# EAGLE design wireless-dong-mk-2.0 (EAGLE 6.5.0)
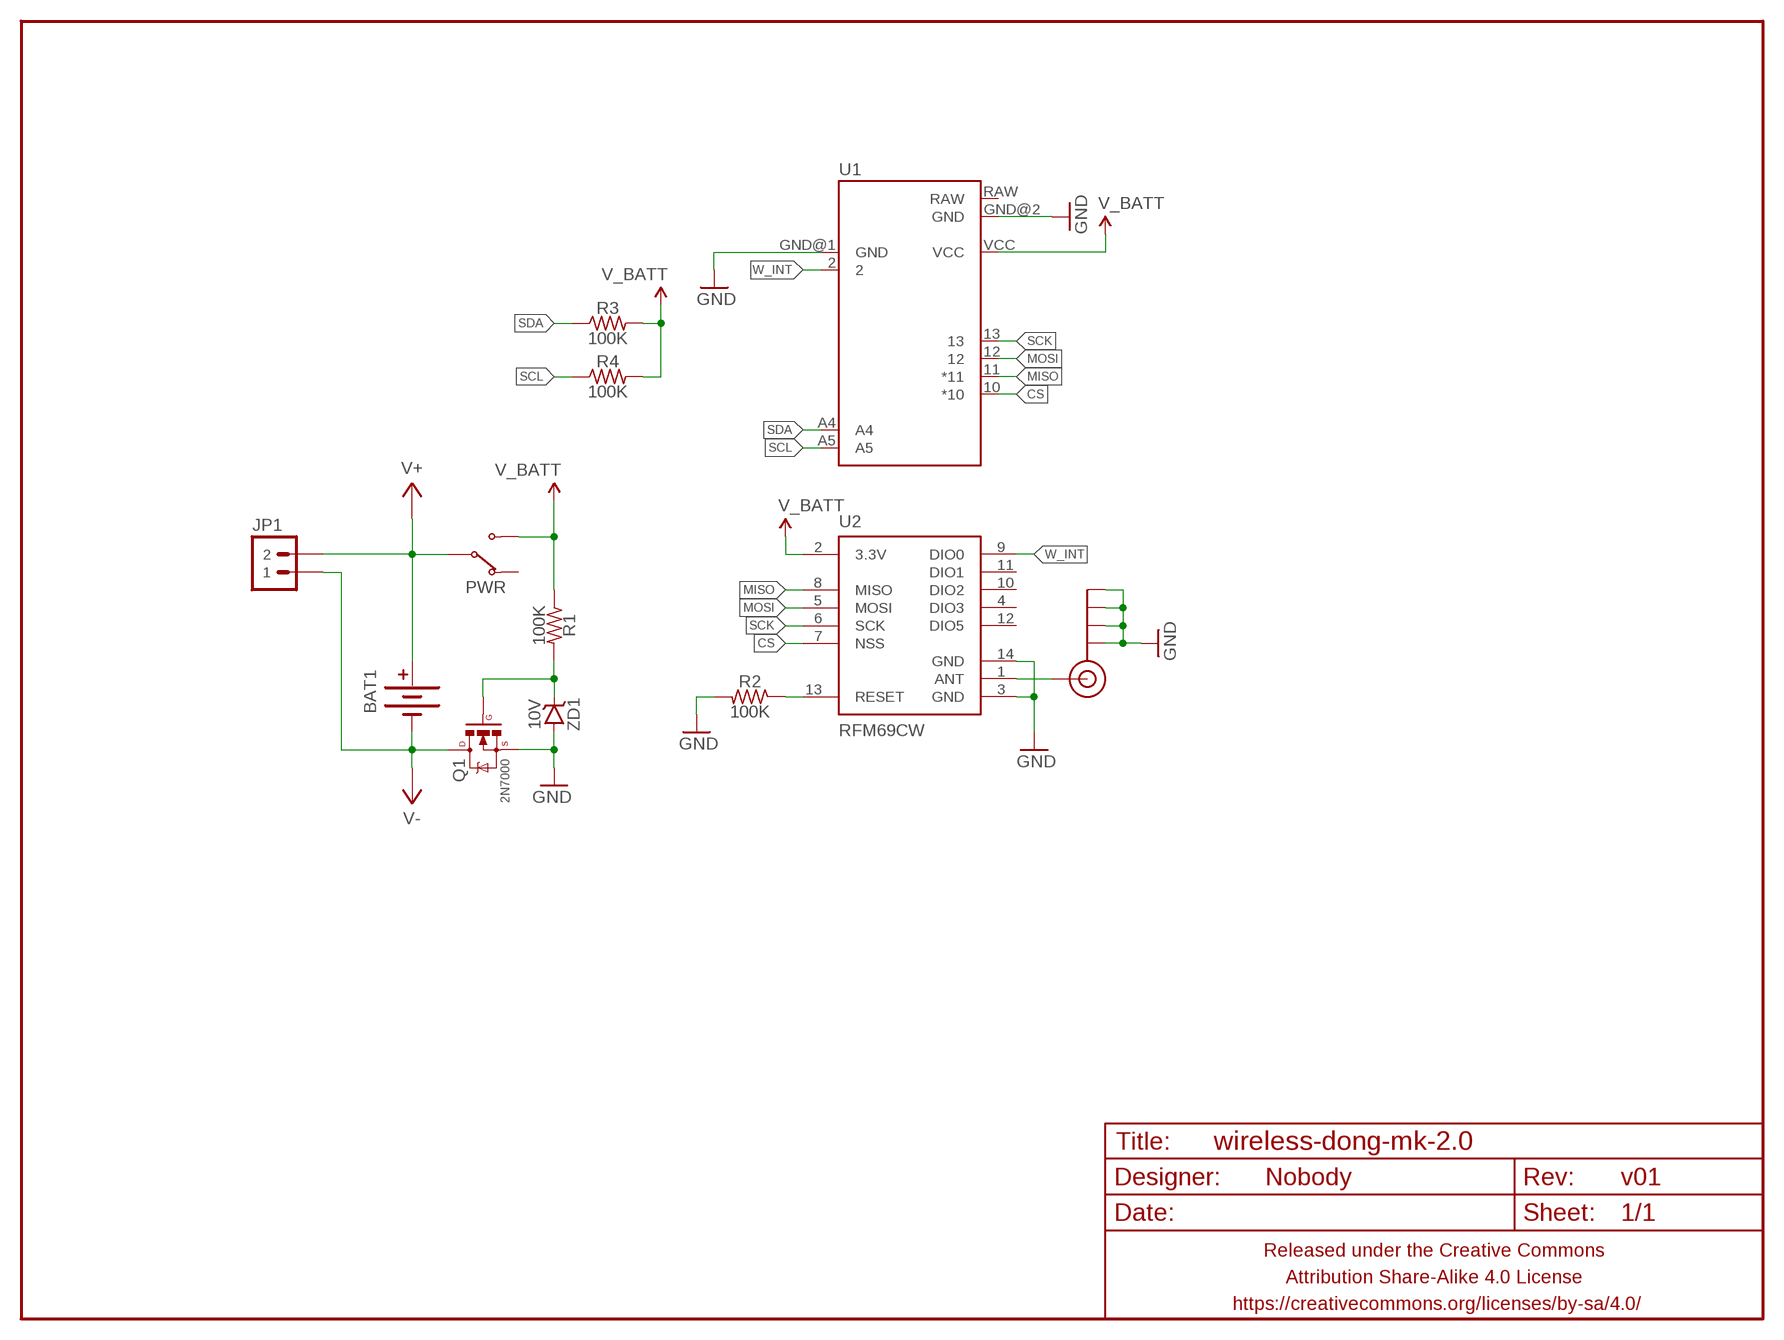
[diagram p0: schematic, sheet 1]

## Parts
BAT1  BATTERY20PTH_TOPLOAD  [BATTCON_20MM_PTH_TOPLOAD]
FRAME1  FRAME-LETTERNO_PACKAGE  [DUMMY]
J$1  SMA_EDGE  [SMA-EDGE]
JP1  M02PTH-CENTERED-R+  [1X02-CENTER-R+]
PWR  SWITCH-SPDTPTH-RA-2.54MM  [SPDT-RA-2.54MM]
Q1  2N7000  MOSFET-NCHANNELIRLML2502  [SOT23]
R1  100K  RESISTORR0603  [R0603]
R2  100K  RESISTORR0603  [R0603]
R3  100K  RESISTORR0603  [R0603]
R4  100K  RESISTORR0603  [R0603]
U1  ARDUINO_PRO_MINI_BOATON_ONE_MF  [ARDUINO_PRO_MINI_BOAT]
U2  RFM69CW  [RFM69CW-XXXS2]
ZD1  10V  DIODE-ZENERSOT23  [SOT23]

## Nets
CS: U1.10(*10) U2.7(NSS)
GND: J$1.GND@0(GND) J$1.GND@1(GND) J$1.GND@2(GND) J$1.GND@3(GND) Q1.2(S) R2.2 U1.GND@1(GND) U1.GND@2(GND) U2.3(GND) U2.14(GND) ZD1.1(A) ZD1.2(A)
MISO: U1.11(*11) U2.8(MISO)
MOSI: U1.12 U2.5(MOSI)
N$1: Q1.1(G) R1.2 ZD1.3(C)
N$3: J$1.SIG(SIGNAL) U2.1(ANT)
N$8: R2.1 U2.13(RESET)
SCK: U1.13 U2.6(SCK)
SCL: R4.1 U1.A5
SDA: R3.1 U1.A4
V+: BAT1.+ JP1.2 PWR.2(COM)
V-: BAT1.- JP1.1 Q1.3(D)
V_BATT: PWR.3(NO) R1.1 R3.2 R4.2 U1.VCC U2.2(3.3V)
W_INT: U1.2 U2.9(DIO0)
Unconnected: PWR.1(NC) U1.RAW U2.4(DIO3) U2.10(DIO2) U2.11(DIO1) U2.12(DIO5)

## Library data of the parts
BAT1 = A_butts:BATTERY: Battery Holders Various common sizes : AA, AAA, 20mm coin cell and 12mm coin cell. 20MM_4LEGS, BATT-10373
FRAME1 = A_butts:FRAME-LETTER: Schematic Frame Standard 8.5x11 US Letter frame; DESIGNER: Nobody; VERSION: v01
J$1 = A_butts:SMA_EDGE: SMA Antenna Connector End launch SMA connector. The paste layer has been removed so that the connector can be hand soldered onto the board after reflow.
JP1 = A_butts:M02: Standard 2-pin 0.1" header. Use with - straight break away headers ( PRT-00116) - right angle break away headers (PRT-00553) - swiss pins (PRT-00743) - machine pins (PRT-00117) - female headers (PRT-00115) Molex polarized connector foot print use with: PRT-08233 with associated crimp pins and housings. 2.54_SCREWTERM for use with PRT-10571. 3.5mm Screw Terminal footprints for PRT-08084 5mm Screw Terminal footprints for use with PRT-08433
PWR = A_butts:SWITCH-SPDT
Q1 = A_butts:MOSFET-NCHANNEL: Common NMOSFET Parts MFG P/N Store ID Prod ID FDD8780 TRANS-09984 SI7820DN TRANS-11055 FDS6630A IC-08089 2N7002PW TRANS-11151 FQP30N06L COM-10213 TRANS-10060 BSS123LT1G TRANS-08345 BSS138 TRANS-00830 BS170 2N7000
R1-R4 = A_butts:RESISTOR: RESISTOR, American symbol
U1 = A_butts:ARDUINO_PRO_MINI_BOAT
U2 = A_butts:RFM69
ZD1 = A_butts:DIODE-ZENER: Zener Diode Production Part - 8199 3.4V Zener Voltage

## Board
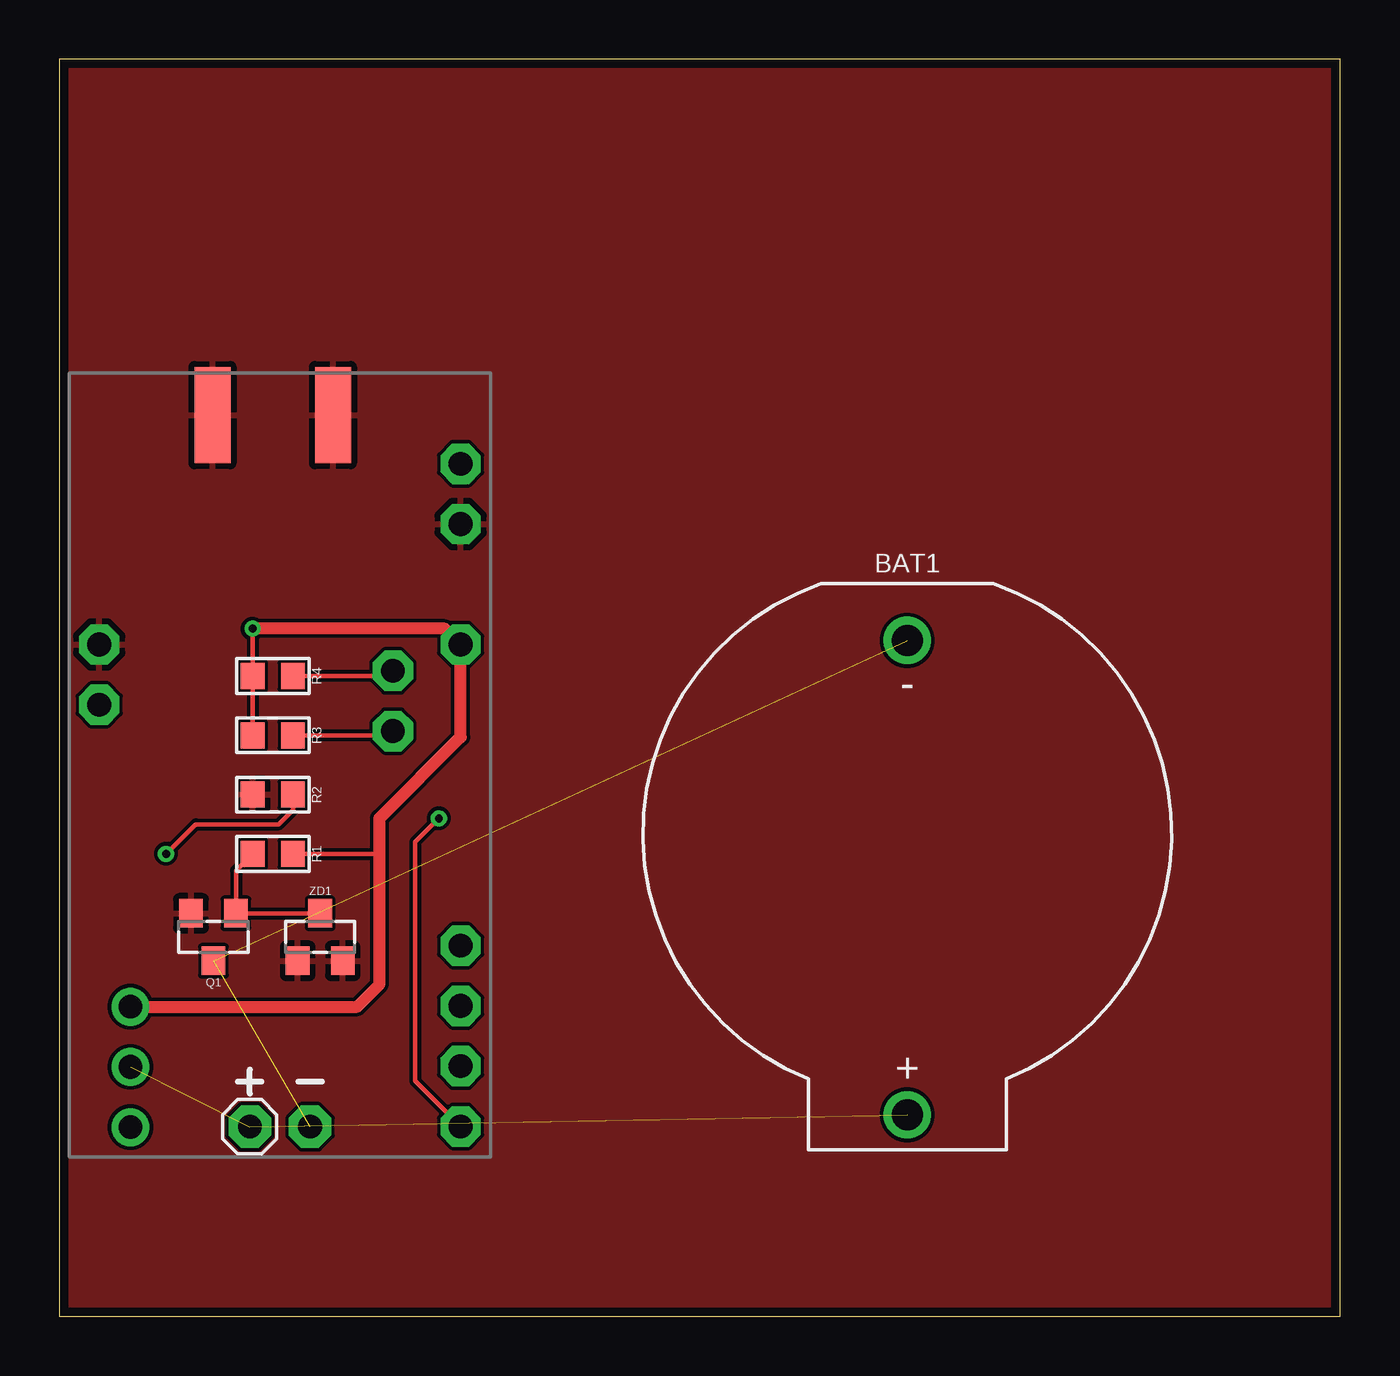
[diagram p1: board, top side]
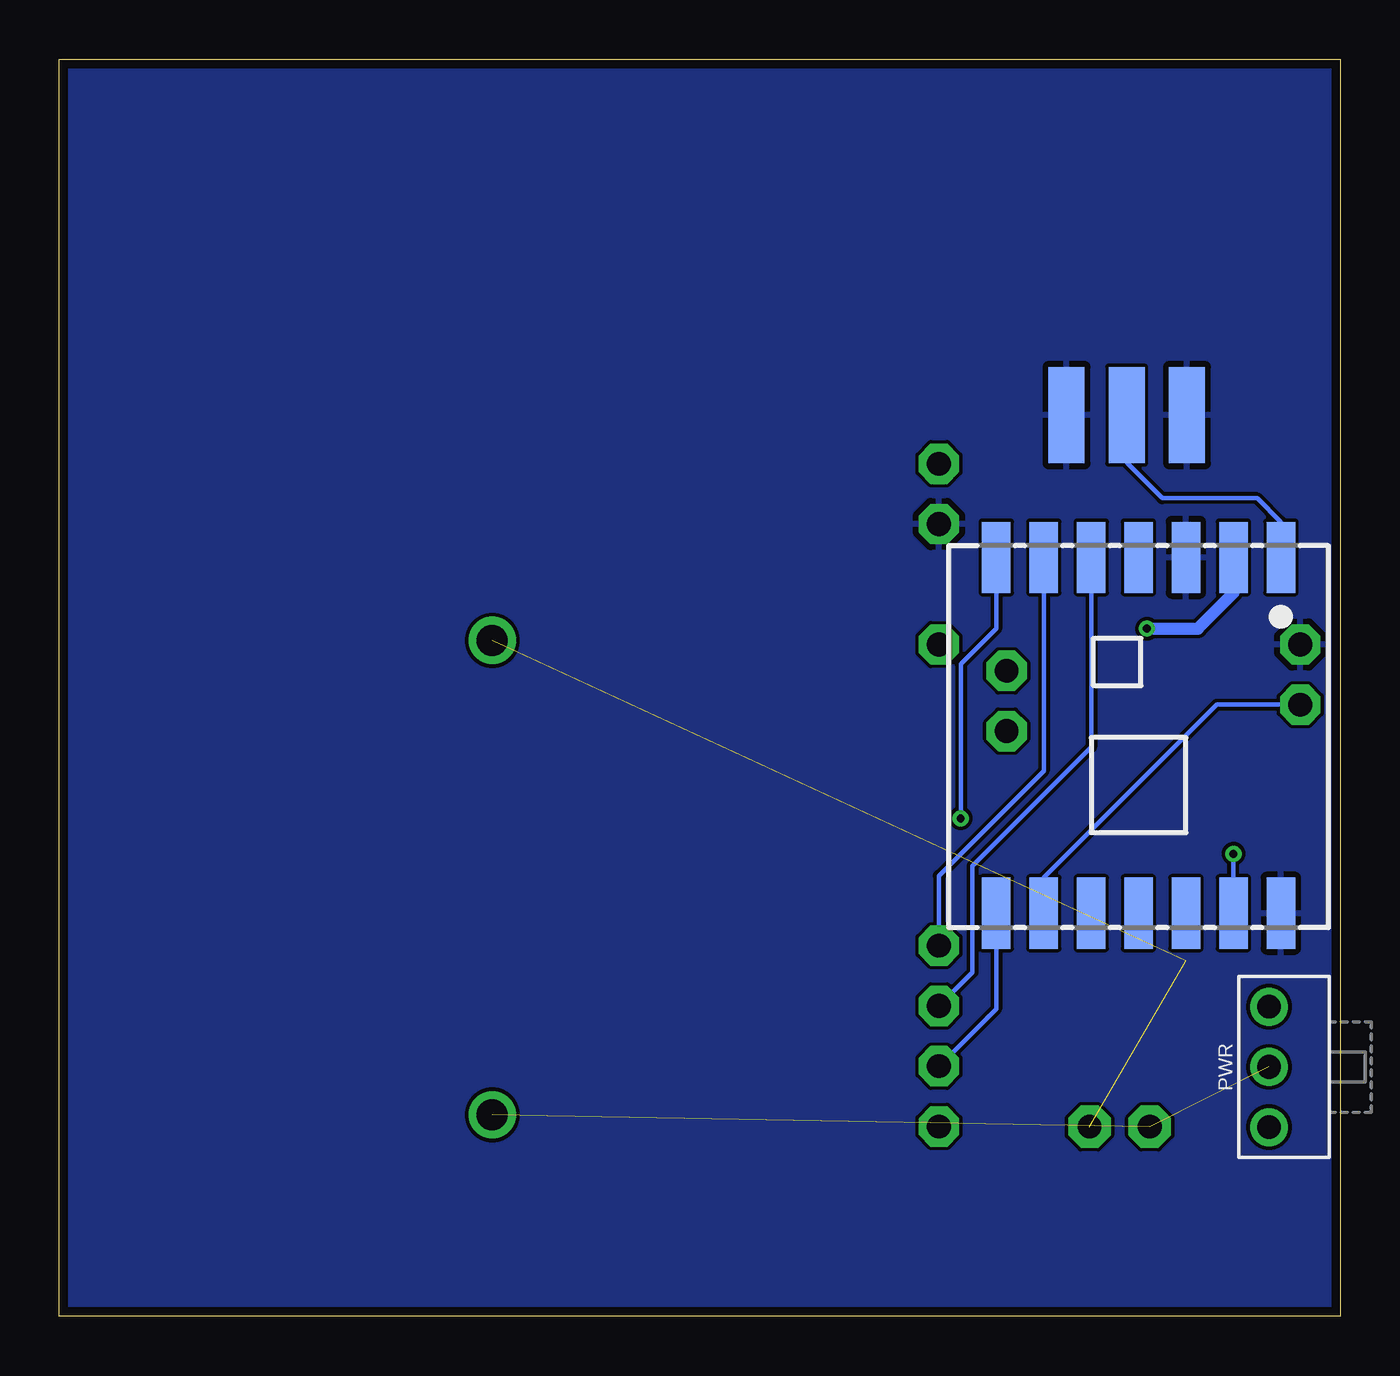
[diagram p2: board, bottom side, seen from below]

Size 54 x 53 mm. Coordinates in mm from the lower left corner, seen from the top.
Outline: 0,0 54,0 54,53 0,53 0,0
Copper layers (1*16): Top 0.0356mm / dielectric 1.5011mm / Bottom 0.0356mm
Design rules "LaenPCBOrder_2": minimum track width 6mil, minimum drill 13mil, track to track 6mil, track to pad 6mil, pad to pad 6mil, via to via 6mil, smd to smd 6mil, copper to edge 15mil, drill to drill 6mil, minimum pad ring 7mil, minimum via ring 7mil, stop-mask expansion 3mil, vias tented up to drill 20mil, thermal gap 10mil

### Footprints (pad centres in the part's own frame; a part is rotated, then mirrored left to right if it is on the bottom)
BATTCON_20MM_PTH_TOPLOAD = drill 1.3 pad 2: + 11.85,0; - -8.15,0
SMA-EDGE = smd 1.524 x 4.064: GND@0 -2.54,0; GND@1 2.54,0; SIG 0,0 | smd 1.524 x 4.064 bottom: GND@2 -2.54,0; GND@3 2.54,0
1X02-CENTER-R+ = drill 1 pad 1.8 octagon: 1 -1.27,0; 2 1.27,0
SPDT-RA-2.54MM = drill 1 pad 1.6: 1 0,0; 2 2.54,0; 3 5.08,0
SOT23 = smd 1 x 1.2: 1 -0.95,-1; 2 0.95,-1; 3 0,1
R0603 = smd 1 x 1.1: 1 -0.85,0; 2 0.85,0
ARDUINO_PRO_MINI_BOAT = drill 1 pad 1.7 octagon: 2 -7.62,2.54; 10 7.62,-15.24; 11 7.62,-12.7; 12 7.62,-10.16; 13 7.62,-7.62; A4 4.763,1.429; A5 4.763,3.969; GND@1 -7.62,5.08; GND@2 7.62,10.16; RAW 7.62,12.7; VCC 7.62,5.08
RFM69CW-XXXS2 = smd 3 x 1.2: 1 -7.5,6; 2 -7.5,4; 3 -7.5,2; 4 -7.5,0; 5 -7.5,-2; 6 -7.5,-4; 7 -7.5,-6; 8 7.5,-6; 9 7.5,-4; 10 7.5,-2; 11 7.5,0; 12 7.5,2; 13 7.5,4; 14 7.5,6

### Placement (x,y rotation side)
BAT1  35.75,20.35 270 top
FRAME1  0,0 0 top
J$1  9,38 180 bottom
JP1  9.3,8 180 top
PWR  3,7.98 90 bottom
Q1  6.5,16 180 top
R1  9,19.5 180 top
R2  9,22 180 top
R3  9,24.5 180 top
R4  9,27 180 top
U1  9.3,23.25 0 top
U2  8.5,24.5 270 bottom
ZD1  11,16 0 top

### Tracks (layer width: path | path; a pad name or v marks a point on that pad's centre or on a via)
CS  (via drill 0.33)
  Top 0.2: v16,21 15,20 15,9.93 U1.10
  Bottom 0.2: U2.7 14.5,29 16,27.5 v16,21
GND
  pour Top: -0.1,-0.1 -0.1,53.1 54.1,53.1 54.1,-0.1
  pour Bottom: -0.1,-0.1 -0.1,53.1 54.1,53.1 54.1,-0.1
MISO
  Bottom 0.2: U2.8 14.5,12.97 U1.11
MOSI
  Bottom 0.2: U2.5 10.5,24 15.5,19 15.5,14.51 U1.12
N$1
  Top 0.2: ZD1.3 Q1.1 7.45,18.8 R1.2
N$3
  Bottom 0.2: U2.1 2.5,33.5 3.5,34.5 7.5,34.5 9,36 J$1.SIG
N$8  (via drill 0.33)
  Top 0.2: v4.5,19.5 5.75,20.75 9.25,20.75 9.85,21.35 R2.1
  Bottom 0.2: U2.13 v4.5,19.5
SCK
  Bottom 0.2: U2.6 12.5,23 16.92,18.58 U1.13
SCL
  Top 0.2: U1.A5 13.84,27 R4.1
SDA
  Top 0.2: U1.A4 13.88,24.5 R3.1
V+  (2 unrouted)
V-  (2 unrouted)
V_BATT  (via drill 0.33)
  Top 0.2: v8.15,29 R4.2 R3.2 | R1.1 13.5,19.5
  Top 0.5: v8.15,29 16.25,29 U1.VCC 16.92,24.42 13.5,21 13.5,19.5 13.5,14 12.56,13.06 PWR.3
  Bottom 0.5: v8.15,29 6,29 4.5,30.5 U2.2
W_INT
  Bottom 0.2: U2.9 12.5,18.5 5.21,25.79 U1.2